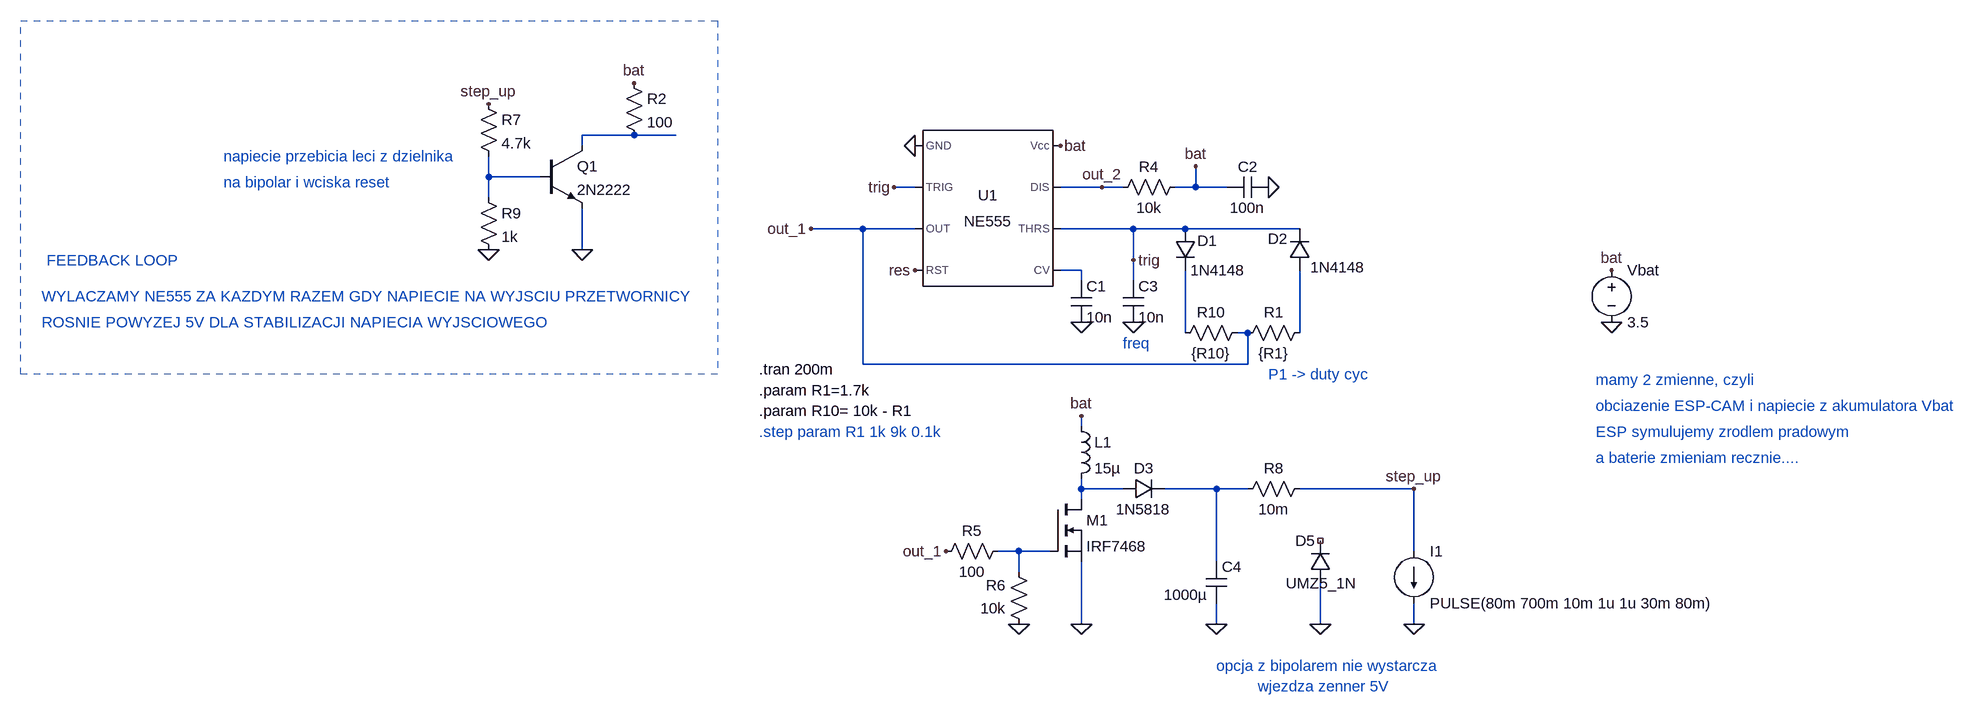
[diagram p0: schematic step_up_pot.asc]
step_up_pot.asc, the LTspice schematic file:
Version 4.1
SHEET 1 1716 1008
WIRE -352 32 -432 32
WIRE -288 32 -352 32
WIRE -432 48 -432 32
WIRE -576 96 -576 64
WIRE -496 96 -576 96
WIRE 80 112 48 112
WIRE 368 112 304 112
WIRE 400 112 368 112
WIRE 512 112 512 80
WIRE 512 112 480 112
WIRE 560 112 512 112
WIRE -576 128 -576 96
WIRE 0 176 -80 176
WIRE 80 176 0 176
WIRE 416 176 304 176
WIRE 496 176 416 176
WIRE 672 176 496 176
WIRE -432 208 -432 144
WIRE 416 224 416 176
WIRE 336 240 304 240
WIRE 336 256 336 240
WIRE 416 256 416 224
WIRE 496 336 496 240
WIRE 592 336 576 336
WIRE 672 336 672 240
WIRE 0 384 0 176
WIRE 592 384 592 336
WIRE 592 384 0 384
WIRE 336 480 336 464
WIRE 336 576 336 560
WIRE 400 576 336 576
WIRE 544 576 464 576
WIRE 592 576 544 576
WIRE 848 576 672 576
WIRE 336 592 336 576
WIRE 240 672 208 672
WIRE 288 672 240 672
WIRE 848 672 848 576
WIRE 544 688 544 576
WIRE 240 704 240 672
WIRE 336 784 336 688
WIRE 544 784 544 752
WIRE 704 784 704 720
WIRE 848 784 848 752
FLAG 336 320 0
FLAG 1152 320 0
FLAG 1152 240 bat
FLAG -80 176 out_1
FLAG 80 48 0
FLAG 416 320 0
FLAG 48 112 trig
FLAG 416 224 trig
FLAG 368 112 out_2
FLAG 624 112 0
FLAG 304 48 bat
FLAG 512 80 bat
FLAG 240 784 0
FLAG 336 784 0
FLAG 544 784 0
FLAG 848 784 0
FLAG 128 672 out_1
FLAG 336 464 bat
FLAG 848 576 step_up
FLAG -352 -48 bat
FLAG -432 208 0
FLAG -576 208 0
FLAG -576 -16 step_up
FLAG 704 784 0
FLAG 80 240 res
SYMBOL Misc\\NE555 192 144 R0
SYMATTR InstName U1
SYMBOL diode 688 240 R180
WINDOW 0 34 49 Left 2
WINDOW 3 -85 5 Left 2
SYMATTR InstName D2
SYMATTR Value 1N4148
SYMBOL res 592 320 R90
WINDOW 0 0 56 VBottom 2
WINDOW 3 32 56 VTop 2
SYMATTR InstName R10
SYMATTR Value {R10}
SYMBOL res 688 320 R90
WINDOW 0 0 56 VBottom 2
WINDOW 3 32 56 VTop 2
SYMATTR InstName R1
SYMATTR Value {R1}
SYMBOL cap 320 256 R0
SYMATTR InstName C1
SYMATTR Value 10n
SYMBOL voltage 1152 224 R0
WINDOW 123 0 0 Left 0
WINDOW 39 0 0 Left 0
SYMATTR InstName Vbat
SYMATTR Value 3.5
SYMBOL cap 400 256 R0
SYMATTR InstName C3
SYMATTR Value 10n
SYMBOL res 496 96 R90
WINDOW 0 0 56 VBottom 2
WINDOW 3 32 56 VTop 2
SYMATTR InstName R4
SYMATTR Value 10k
SYMBOL cap 624 96 R90
WINDOW 0 0 32 VBottom 2
WINDOW 3 32 32 VTop 2
SYMATTR InstName C2
SYMATTR Value 100n
SYMBOL diode 480 176 R0
WINDOW 0 35 18 Left 2
SYMATTR InstName D1
SYMATTR Value 1N4148
SYMBOL nmos 288 592 R0
SYMATTR InstName M1
SYMATTR Value IRF7468
SYMBOL res 224 656 R90
WINDOW 0 0 56 VBottom 2
WINDOW 3 32 56 VTop 2
SYMATTR InstName R5
SYMATTR Value 100
SYMBOL res 256 800 R180
WINDOW 0 36 76 Left 2
WINDOW 3 36 40 Left 2
SYMATTR InstName R6
SYMATTR Value 10k
SYMBOL ind 320 464 R0
SYMATTR InstName L1
SYMATTR Value 15µ
SYMBOL diode 400 592 R270
WINDOW 0 32 32 VTop 2
WINDOW 3 0 32 VBottom 2
SYMATTR InstName D3
SYMATTR Value 1N5818
SYMBOL cap 528 688 R0
WINDOW 3 -65 51 Left 2
SYMATTR Value 1000µ
SYMATTR InstName C4
SYMBOL res 576 592 R270
WINDOW 0 32 56 VTop 2
WINDOW 3 0 56 VBottom 2
SYMATTR InstName R8
SYMATTR Value 10m
SYMBOL res -368 -64 R0
SYMATTR InstName R2
SYMATTR Value 100
SYMBOL current 848 672 R0
WINDOW 123 0 0 Left 0
WINDOW 39 0 0 Left 0
SYMATTR InstName I1
SYMATTR Value PULSE(80m 700m 10m 1u 1u 30m 80m)
SYMBOL npn -496 48 R0
SYMATTR InstName Q1
SYMATTR Value 2N2222
SYMBOL res -592 -32 R0
SYMATTR InstName R7
SYMATTR Value 4.7k
SYMBOL res -592 112 R0
SYMATTR InstName R9
SYMATTR Value 1k
SYMBOL diode 720 720 R180
WINDOW 0 24 64 Left 2
WINDOW 3 -41 -1 Left 2
SYMATTR InstName D5
SYMATTR Value UMZ5_1N
TEXT -160 392 Left 2 !.tran 200m
TEXT 400 352 Left 2 ;freq
TEXT 624 400 Left 2 ;P1 -> duty cyc
TEXT -160 424 Left 2 !.param R1=1.7k
TEXT -160 456 Left 2 !.param R10= 10k - R1
TEXT -160 488 Left 2 ;.step param R1 1k 9k 0.1k
TEXT -984 104 Left 2 ;na bipolar i wciska reset
TEXT -984 64 Left 2 ;napiecie przebicia leci z dzielnika
TEXT -1264 280 Left 2 ;WYLACZAMY NE555 ZA KAZDYM RAZEM GDY NAPIECIE NA WYJSCIU PRZETWORNICY
TEXT -1264 320 Left 2 ;ROSNIE POWYZEJ 5V DLA STABILIZACJI NAPIECIA WYJSCIOWEGO
TEXT 544 848 Left 2 ;opcja z bipolarem nie wystarcza
TEXT 608 880 Left 2 ;wjezdza zenner 5V
TEXT 1128 408 Left 2 ;mamy 2 zmienne, czyli
TEXT 1128 448 Left 2 ;obciazenie ESP-CAM i napiecie z akumulatora Vbat
TEXT 1128 488 Left 2 ;ESP symulujemy zrodlem pradowym
TEXT 1128 528 Left 2 ;a baterie zmieniam recznie....
TEXT -1256 224 Left 2 ;FEEDBACK LOOP
RECTANGLE Normal -224 400 -1296 -144 2

The netlist it stands for:
* step_up_pot.asc
X§U1 0 trig out_1 res N003 trig out_2 bat NE555  ; pins GND TRIG OUT RST CV THRS DIS Vcc
D2 N005 trig 1N4148
R10 out_1 N004 {R10}
R1 N005 out_1 {R1}
C1 N003 0 10n
Vbat bat 0 3.5
C3 trig 0 10n
R4 bat out_2 10k
C2 0 bat 100n
D1 trig N004 1N4148
M1 N006 N008 0 0 IRF7468
R5 N008 out_1 100
R6 0 N008 10k
L1 bat N006 15µ
D3 N006 N007 1N5818
C4 N007 0 1000µ
R8 N007 step_up 10m
R2 bat N001 100
I1 step_up 0 PULSE(80m 700m 10m 1u 1u 30m 80m)
Q1 N001 N002 0 0 2N2222
R7 step_up N002 4.7k
R9 N002 0 1k
D5 0 NC_01 UMZ5_1N
.model D D
.lib standard.dio
.model NPN NPN
.model PNP PNP
.lib standard.bjt
.model NMOS NMOS
.model PMOS PMOS
.lib standard.mos
.tran 200m
* freq
* P1 -> duty cyc
.param R1=1.7k
.param R10= 10k - R1
* .step param R1 1k 9k 0.1k
* na bipolar i wciska reset
* napiecie przebicia leci z dzielnika
* WYLACZAMY NE555 ZA KAZDYM RAZEM GDY NAPIECIE NA WYJSCIU PRZETWORNICY
* ROSNIE POWYZEJ 5V DLA STABILIZACJI NAPIECIA WYJSCIOWEGO
* opcja z bipolarem nie wystarcza
* wjezdza zenner 5V
* mamy 2 zmienne, czyli
* obciazenie ESP-CAM i napiecie z akumulatora Vbat
* ESP symulujemy zrodlem pradowym
* a baterie zmieniam recznie....
* FEEDBACK LOOP
.lib NE555.sub
.backanno
.end